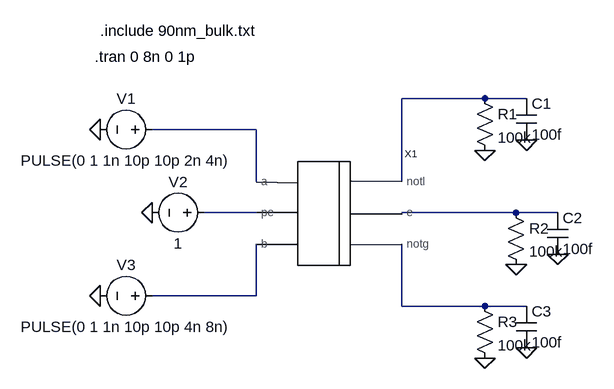
[diagram p0: schematic test_one_comp.asc]
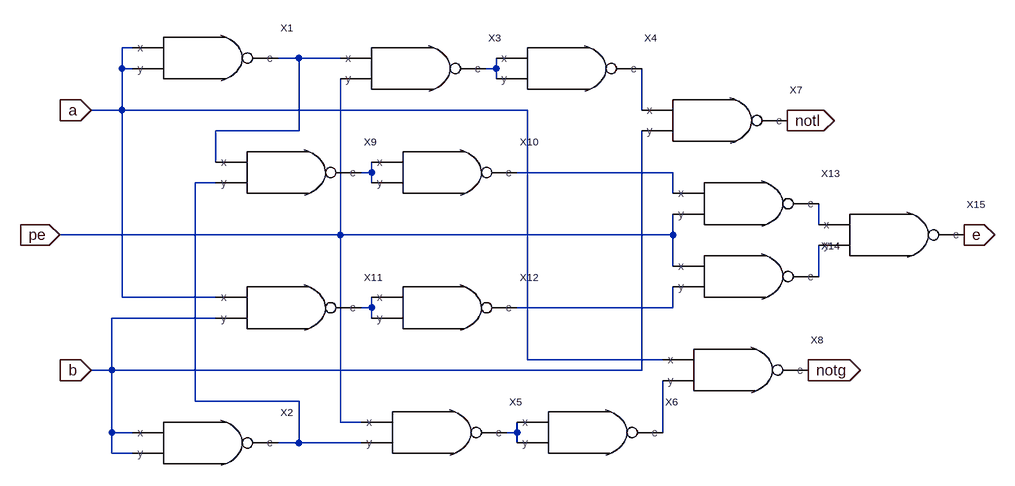
[diagram p1: sub-circuit one_comp.asc]
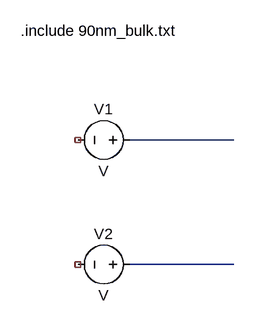
[diagram p2: sub-circuit nand.asc]
test_one_comp.asc, the LTspice schematic file:
Version 4
SHEET 1 880 680
WIRE 464 0 336 0
WIRE 528 0 464 0
WIRE 112 48 -48 48
WIRE 112 128 112 48
WIRE 336 128 336 0
WIRE 112 176 32 176
WIRE 512 176 336 176
WIRE 576 176 512 176
WIRE 112 304 112 224
WIRE 112 304 -48 304
WIRE 336 320 336 224
WIRE 464 320 336 320
WIRE 528 320 464 320
FLAG 464 80 0
FLAG 528 64 0
FLAG 512 256 0
FLAG 576 240 0
FLAG 464 400 0
FLAG 528 384 0
FLAG -128 48 0
FLAG -48 176 0
FLAG -128 304 0
SYMBOL one_comp 224 160 R0
SYMATTR InstName X1
SYMBOL res 448 -16 R0
SYMATTR InstName R1
SYMATTR Value 100k
SYMBOL cap 512 0 R0
SYMATTR InstName C1
SYMATTR Value 100f
SYMBOL res 496 160 R0
SYMATTR InstName R2
SYMATTR Value 100k
SYMBOL cap 560 176 R0
SYMATTR InstName C2
SYMATTR Value 100f
SYMBOL res 448 304 R0
SYMATTR InstName R3
SYMATTR Value 100k
SYMBOL cap 512 320 R0
SYMATTR InstName C3
SYMATTR Value 100f
SYMBOL voltage -32 48 R90
WINDOW 0 -32 56 VBottom 2
WINDOW 3 32 56 VTop 2
WINDOW 123 0 0 Left 0
WINDOW 39 0 0 Left 0
SYMATTR InstName V1
SYMATTR Value PULSE(0 1 1n 10p 10p 2n 4n)
SYMBOL voltage 48 176 R90
WINDOW 0 -32 56 VBottom 2
WINDOW 3 32 56 VTop 2
WINDOW 123 0 0 Left 0
WINDOW 39 0 0 Left 0
SYMATTR InstName V2
SYMATTR Value 1
SYMBOL voltage -32 304 R90
WINDOW 0 -32 56 VBottom 2
WINDOW 3 32 56 VTop 2
WINDOW 123 0 0 Left 0
WINDOW 39 0 0 Left 0
SYMATTR InstName V3
SYMATTR Value PULSE(0 1 1n 10p 10p 4n 8n)
TEXT -136 -64 Left 2 !.tran 0 8n 0 1p
TEXT -128 -104 Left 2 !.include 90nm_bulk.txt

one_comp.asc, the sub-circuit schematic file:
Version 4
SHEET 1 1380 680
WIRE -80 -80 -96 -80
WIRE 176 -64 144 -64
WIRE 240 -64 176 -64
WIRE -96 -48 -96 -80
WIRE -80 -48 -96 -48
WIRE 480 -48 480 -64
WIRE 480 -48 464 -48
WIRE 480 -32 480 -48
WIRE -96 16 -96 -48
WIRE -96 16 -144 16
WIRE 528 16 -96 16
WIRE 704 16 704 -48
WIRE 176 48 176 -64
WIRE 176 48 48 48
WIRE 48 96 48 48
WIRE 288 112 288 96
WIRE 288 112 272 112
WIRE 752 112 512 112
WIRE 48 128 16 128
WIRE 288 128 288 112
WIRE 752 144 752 112
WIRE 976 192 976 160
WIRE 240 208 240 -32
WIRE 240 208 -192 208
WIRE 752 208 752 176
WIRE 752 208 240 208
WIRE 752 256 752 208
WIRE 976 272 976 224
WIRE -96 304 -96 16
WIRE 48 304 -96 304
WIRE 288 320 288 304
WIRE 288 320 272 320
WIRE 752 320 752 288
WIRE 752 320 512 320
WIRE 48 336 -112 336
WIRE 288 336 288 320
WIRE 528 400 528 16
WIRE 736 400 528 400
WIRE -112 416 -112 336
WIRE -112 416 -144 416
WIRE 704 416 704 48
WIRE 704 416 -112 416
WIRE 16 464 16 128
WIRE 176 464 16 464
WIRE 240 496 240 208
WIRE 272 496 240 496
WIRE -112 512 -112 416
WIRE -80 512 -112 512
WIRE 512 512 512 496
WIRE 512 512 496 512
WIRE 736 512 736 432
WIRE 176 528 176 464
WIRE 176 528 144 528
WIRE 272 528 176 528
WIRE 512 528 512 512
WIRE -112 544 -112 512
WIRE -80 544 -112 544
FLAG -144 16 a
IOPIN -144 16 In
FLAG -192 208 pe
IOPIN -192 208 In
FLAG -144 416 b
IOPIN -144 416 In
FLAG 928 32 notl
IOPIN 928 32 Out
FLAG 1200 208 e
IOPIN 1200 208 Out
FLAG 960 416 notg
IOPIN 960 416 Out
SYMBOL nand 0 -80 R0
SYMATTR InstName X1
SYMBOL nand 0 512 R0
SYMATTR InstName X2
SYMBOL nand 320 -64 R0
SYMATTR InstName X3
SYMBOL nand 560 -64 R0
SYMATTR InstName X4
SYMBOL nand 352 496 R0
SYMATTR InstName X5
SYMBOL nand 592 496 R0
SYMATTR InstName X6
SYMBOL nand 784 16 R0
SYMATTR InstName X7
SYMBOL nand 816 400 R0
SYMATTR InstName X8
SYMBOL nand 128 96 R0
SYMATTR InstName X9
SYMBOL nand 368 96 R0
SYMATTR InstName X10
SYMBOL nand 128 304 R0
SYMATTR InstName X11
SYMBOL nand 368 304 R0
SYMATTR InstName X12
SYMBOL nand 832 144 R0
SYMATTR InstName X13
SYMBOL nand 832 256 R0
SYMATTR InstName X14
SYMBOL nand 1056 192 R0
SYMATTR InstName X15

nand.asc, the sub-circuit schematic file:
Version 4
SHEET 1 880 680
WIRE 80 224 -80 224
WIRE 80 416 -80 416
SYMBOL voltage -64 224 R90
WINDOW 0 -32 56 VBottom 2
WINDOW 3 32 56 VTop 2
SYMATTR InstName V1
SYMBOL voltage -64 416 R90
WINDOW 0 -32 56 VBottom 2
WINDOW 3 32 56 VTop 2
SYMATTR InstName V2
TEXT -248 56 Left 2 !.include 90nm_bulk.txt

The netlist it stands for:
* test_one_comp.asc
XX1 N002 N005 N003 N001 N004 N006 one_comp
R1 N001 0 100k
C1 N001 0 100f
R2 N004 0 100k
C2 N004 0 100f
R3 N006 0 100k
C3 N006 0 100f
V1 N002 0 PULSE(0 1 1n 10p 10p 2n 4n)
V2 N003 0 1
V3 N005 0 PULSE(0 1 1n 10p 10p 4n 8n)

* block symbol definitions
.subckt one_comp a b pe notl e notg
XX1 a a N001 nand
XX2 b b N006 nand
XX3 N001 pe N002 nand
XX4 N002 N002 N003 nand
XX5 pe N006 N011 nand
XX6 N011 N011 N012 nand
XX7 N003 b notl nand
XX8 a N012 notg nand
XX9 N001 N006 N004 nand
XX10 N004 N004 N005 nand
XX11 a b N009 nand
XX12 N009 N009 N010 nand
XX13 N005 pe N007 nand
XX14 pe N010 N008 nand
XX15 N007 N008 e nand
.ends one_comp

.subckt nand x y c
V1 N001 NC_01 V
V2 N002 NC_02 V
.include 90nm_bulk.txt
.ends nand

.tran 0 8n 0 1p
.include 90nm_bulk.txt
.backanno
.end